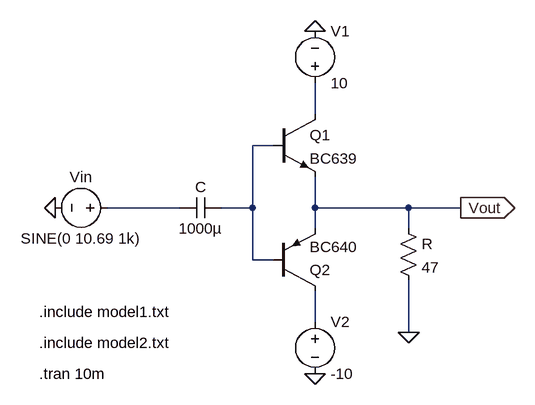
[diagram p0: schematic classB.asc]
classB.asc, the LTspice schematic file:
Version 4
SHEET 1 880 680
WIRE 272 48 272 0
WIRE 208 96 176 96
WIRE 64 192 -48 192
WIRE 176 192 176 96
WIRE 176 192 128 192
WIRE 272 192 272 144
WIRE 416 192 272 192
WIRE 496 192 416 192
WIRE 272 224 272 192
WIRE 416 224 416 192
WIRE 176 272 176 192
WIRE 208 272 176 272
WIRE 272 368 272 320
WIRE 416 384 416 304
FLAG 416 384 0
FLAG 496 192 Vout
IOPIN 496 192 Out
FLAG 272 -80 0
FLAG 272 448 0
FLAG -128 192 0
SYMBOL npn 208 48 R0
SYMATTR InstName Q1
SYMATTR Value BC639
SYMBOL pnp 208 320 M180
SYMATTR InstName Q2
SYMATTR Value BC640
SYMBOL res 400 208 R0
SYMATTR InstName R
SYMATTR Value 47
SYMBOL cap 128 176 R90
WINDOW 0 0 32 VBottom 2
WINDOW 3 32 32 VTop 2
SYMATTR InstName C
SYMATTR Value 1000µ
SYMBOL voltage 272 16 M180
WINDOW 0 24 96 Left 2
WINDOW 3 24 16 Left 2
WINDOW 123 0 0 Left 0
WINDOW 39 0 0 Left 0
SYMATTR InstName V1
SYMATTR Value 10
SYMBOL voltage -32 192 M270
WINDOW 0 32 56 VTop 2
WINDOW 3 -32 56 VBottom 2
WINDOW 123 0 0 Left 0
WINDOW 39 0 0 Left 0
SYMATTR InstName Vin
SYMATTR Value SINE(0 10.69 1k)
SYMBOL voltage 272 352 R0
WINDOW 123 0 0 Left 0
WINDOW 39 0 0 Left 0
SYMATTR InstName V2
SYMATTR Value -10
TEXT -152 352 Left 2 !.include model1.txt
TEXT -152 400 Left 2 !.include model2.txt
TEXT -152 448 Left 2 !.tran 10m

The netlist it stands for:
* classB.asc
Q1 N001 N002 Vout 0 BC639
Q2 N004 N002 Vout 0 BC640
R Vout 0 47
C N002 N003 1000µ
V1 N001 0 10
Vin N003 0 SINE(0 10.69 1k)
V2 N004 0 -10
.model NPN NPN
.model PNP PNP
.lib standard.bjt
.include model1.txt
.include model2.txt
.tran 10m
.backanno
.end